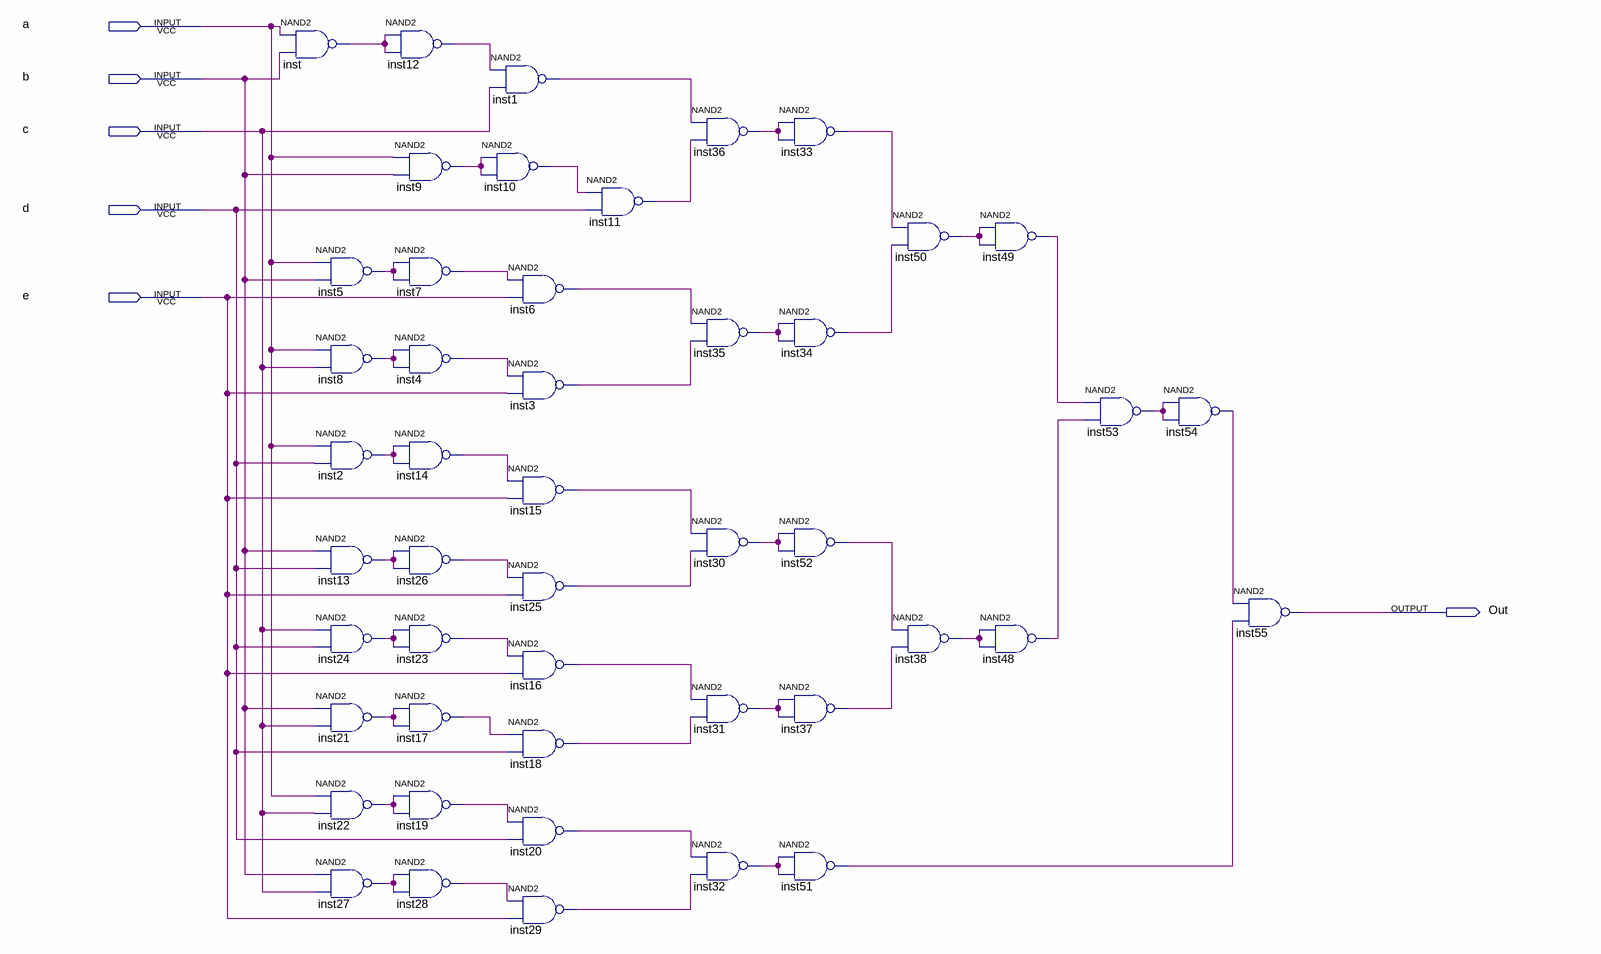
[diagram p0: schematic sheet]
// Quartus schematic malorElement2nand.bdf as structural Verilog: 47 symbols, 6 pins
module malorElement2nand (
  input  a,
  input  b,
  input  c,
  input  d,
  input  e,
  output Out
);

  wire inst1_out, inst2_out, inst3_out, inst4_out, inst5_out, inst6_out, inst7_out, inst8_out, inst9_out,
       inst10_out, inst11_out, inst12_out, inst13_out, inst14_out, inst15_out, inst16_out, inst17_out,
       inst18_out, inst19_out, inst20_out, inst21_out, inst22_out, inst23_out, inst24_out, inst25_out,
       inst26_out, inst27_out, inst28_out, inst29_out, inst30_out, inst31_out, inst32_out, inst33_out,
       inst34_out, inst35_out, inst36_out, inst37_out, inst38_out, inst48_out, inst49_out, inst50_out,
       inst51_out, inst52_out, inst53_out, inst54_out, inst_out;

  nand inst (inst_out, a, b);
  nand inst5 (inst5_out, a, b);
  nand inst8 (inst8_out, a, c);
  nand inst2 (inst2_out, a, d);
  nand inst13 (inst13_out, b, d);
  nand inst24 (inst24_out, c, d);
  nand inst21 (inst21_out, b, c);
  nand inst22 (inst22_out, a, c);
  nand inst27 (inst27_out, b, c);
  nand inst12 (inst12_out, inst_out, inst_out);
  nand inst9 (inst9_out, a, b);
  nand inst7 (inst7_out, inst5_out, inst5_out);
  nand inst4 (inst4_out, inst8_out, inst8_out);
  nand inst14 (inst14_out, inst2_out, inst2_out);
  nand inst26 (inst26_out, inst13_out, inst13_out);
  nand inst23 (inst23_out, inst24_out, inst24_out);
  nand inst17 (inst17_out, inst21_out, inst21_out);
  nand inst19 (inst19_out, inst22_out, inst22_out);
  nand inst28 (inst28_out, inst27_out, inst27_out);
  nand inst1 (inst1_out, inst12_out, c);
  nand inst10 (inst10_out, inst9_out, inst9_out);
  nand inst6 (inst6_out, inst7_out, e);
  nand inst3 (inst3_out, inst4_out, e);
  nand inst15 (inst15_out, inst14_out, e);
  nand inst25 (inst25_out, inst26_out, e);
  nand inst16 (inst16_out, inst23_out, e);
  nand inst18 (inst18_out, inst17_out, d);
  nand inst20 (inst20_out, inst19_out, d);
  nand inst29 (inst29_out, inst28_out, e);
  nand inst11 (inst11_out, inst10_out, d);
  nand inst36 (inst36_out, inst1_out, inst11_out);
  nand inst35 (inst35_out, inst6_out, inst3_out);
  nand inst30 (inst30_out, inst15_out, inst25_out);
  nand inst31 (inst31_out, inst16_out, inst18_out);
  nand inst32 (inst32_out, inst20_out, inst29_out);
  nand inst33 (inst33_out, inst36_out, inst36_out);
  nand inst34 (inst34_out, inst35_out, inst35_out);
  nand inst52 (inst52_out, inst30_out, inst30_out);
  nand inst37 (inst37_out, inst31_out, inst31_out);
  nand inst51 (inst51_out, inst32_out, inst32_out);
  nand inst50 (inst50_out, inst33_out, inst34_out);
  nand inst38 (inst38_out, inst52_out, inst37_out);
  nand inst49 (inst49_out, inst50_out, inst50_out);
  nand inst48 (inst48_out, inst38_out, inst38_out);
  nand inst53 (inst53_out, inst49_out, inst48_out);
  nand inst54 (inst54_out, inst53_out, inst53_out);
  nand inst55 (Out, inst54_out, inst51_out);
endmodule
